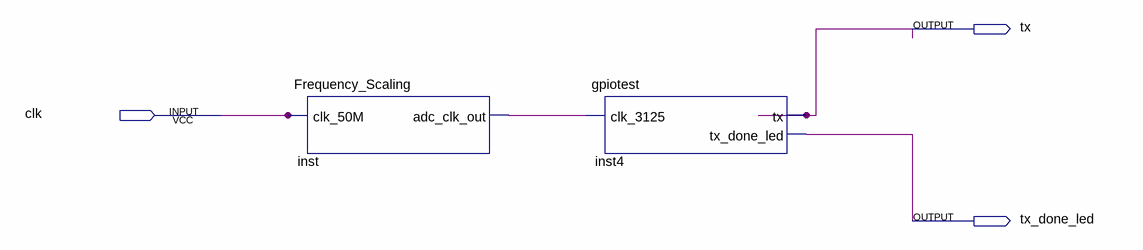
[diagram p0: schematic sheet]
// Quartus schematic topBlockModule.bdf as structural Verilog: 2 symbols, 3 pins
module topBlockModule (
  input  clk,
  output tx,
  output tx_done_led
);

  wire inst_adc_clk_out;

  Frequency_Scaling inst (.clk_50M(clk), .adc_clk_out(inst_adc_clk_out));
  gpiotest inst4 (.clk_3125(inst_adc_clk_out), .tx(tx), .tx_done_led(tx_done_led));
endmodule
